# EAGLE design Module_Expansion_Mosfet (EAGLE 9.6.2)
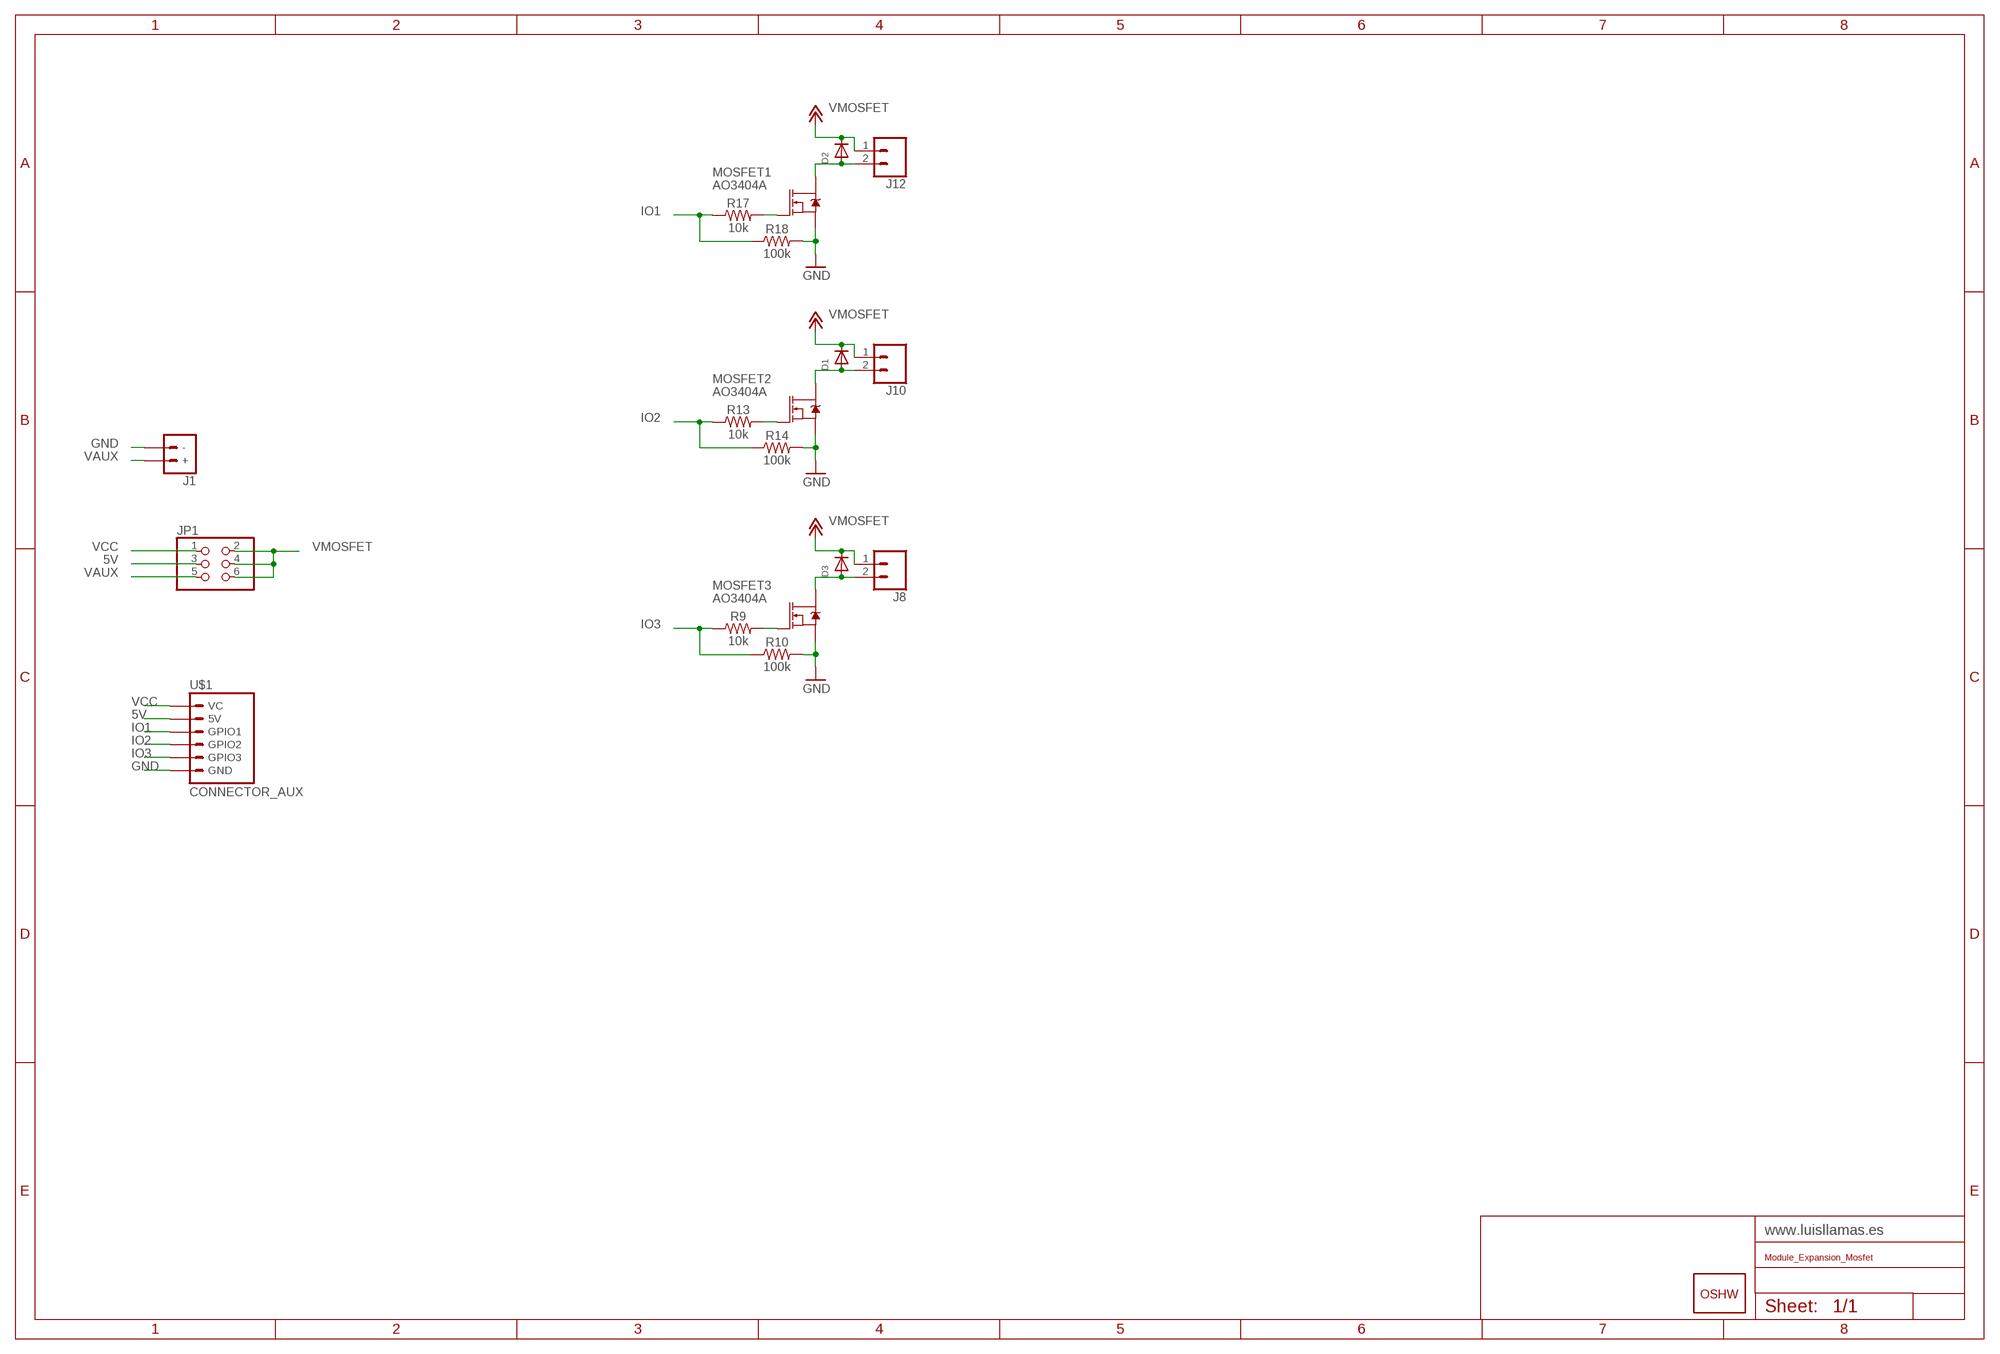
[diagram p0: schematic, sheet 1]

## Parts
D1  DIODESOD-123  [SOD-123]
D2  DIODESOD-123  [SOD-123]
D3  DIODESOD-123  [SOD-123]
GOLD_ORB_SM1  OSHWLOGO_GOLD_ORB_MED  [OSHW1]
J1  POWER-TERMINAL2.54MM_SCREWTERM  [1X02_2.54_SCREWTERM]
J8  CONN_02LOCK_LONGPADS  [1X02_LOCK_LONGPADS]
J10  CONN_02LOCK_LONGPADS  [1X02_LOCK_LONGPADS]
J12  CONN_02LOCK_LONGPADS  [1X02_LOCK_LONGPADS]
JP1  JUMPER_3X2/OCT  [JUMPER_3X2]
MOSFET1  AO3404A  MOSFET-NCH-AO3404A  [SOT23-3]
MOSFET2  AO3404A  MOSFET-NCH-AO3404A  [SOT23-3]
MOSFET3  AO3404A  MOSFET-NCH-AO3404A  [SOT23-3]
R9  10k  RESISTOR1206  [1206]
R10  100k  RESISTOR1206  [1206]
R13  10k  RESISTOR1206  [1206]
R14  100k  RESISTOR1206  [1206]
R17  10k  RESISTOR1206  [1206]
R18  100k  RESISTOR1206  [1206]
U$1  CONNECTOR_AUX  [CONNECTOR_AUX]

## Nets
5V: JP1.3 U$1.5V
GND: J1.- MOSFET1.2(S) MOSFET2.2(S) MOSFET3.2(S) R10.2 R14.2 R18.2 U$1.GND
IO1: R17.1 R18.1 U$1.GPIO1
IO2: R13.1 R14.1 U$1.GPIO2
IO3: R9.1 R10.1 U$1.GPIO3
N$14: MOSFET3.1(G) R9.2
N$15: D3.A J8.2 MOSFET3.3(D)
N$20: MOSFET2.1(G) R13.2
N$21: D1.A J10.2 MOSFET2.3(D)
N$26: MOSFET1.1(G) R17.2
N$27: D2.A J12.2 MOSFET1.3(D)
VAUX: J1.+ JP1.5
VCC: JP1.1 U$1.VC
VMOSFET: D1.C D2.C D3.C J8.1 J10.1 J12.1 JP1.2 JP1.4 JP1.6 ; supply symbol labelled +12V

## Library data of the parts
D1-D3 = adafruit:DIODE: Diode SMADIODE - SMA Surface Mount Package 20V 1A Schottky Diode Digikey: 641-1014-6-ND DO-1N4148 - Through Hole Small Current Diode SOD-123 20V 1 A (.5mV Vf) Schottky Diode - Digikey: MBRX120TPMSCT-ND SOD-323 10V 570mA (.38mV Vf, 3ns) Schottky Diode - Digikey: ZLLS410CT-ND SOD-523 30V 30mA Schottky Diode (RB751S-40TE61) - Digikey: RB751S-40TE61CT-ND SOT23-R/W - SOT23 Package (R = Solder Paste/Reflow Ovens, W = Hand-Soldering) BAT54Film 40V 300mA - Digikey: 497-7162-1-ND
GOLD_ORB_SM1 = LLL_Frames:OSHWLOGO: These are Open-Source Hardware logos.
J1 = LLL_Power:POWER-TERMINAL: Multi connection point. Often used as Generic Header-pin footprint for 0.1 inch spaced/style header connections On any of the 0.1 inch spaced packages, you can populate with these: Break Away Headers - Straight <https://www.sparkfun.com/products/116> (PRT-00116) Break Away Male Headers - Right Angle <https://www.sparkfun.com/products/553> (PRT-00553) Female Headers <https://www.sparkfun.com/products/115> (PRT-00115) Break Away Headers - Machine Pin <https://www.sparkfun.com/products/117> (PRT-00117) Break Away Female Headers - Swiss Machine Pin <https://www.sparkfun.com/products/743> (PRT-00743) For SCREWTERMINALS and SPRING TERMINALS visit here: Screw Terimnals on SparkFun.com <https://www.sparkfun.com/search/results?term=Screw+Terminals> (5mm/3.5mm/2.54mm spacing) This device is also useful as a general connection point to wire up your design to another part of your project. Our various solder wires solder well into these plated through hole pads. Hook-Up Wire - Assortment (Stranded, 22 AWG) <https://www.sparkfun.com/products/11375> (PRT-11375) Hook-Up Wire - Assortment (Solid Core, 22 AWG) <https://www.sparkfun.com/products/11367> (PRT-11367) View the entire wire category on our website here <https://www.sparkfun.com/categories/141> Special notes: Molex polarized connector foot print use with: PRT-08233 with associated crimp pins and housings. 2.54_SCREWTERM for use with PRT-10571. 3.5mm Screw Terminal footprints for PRT-08084 5mm Screw Terminal footprints for use with PRT-08432
J8 J10 J12 = LLL_Connectors:CONN_02: Multi connection point. Often used as Generic Header-pin footprint for 0.1 inch spaced/style header connections On any of the 0.1 inch spaced packages, you can populate with these: Break Away Headers - Straight <https://www.sparkfun.com/products/116> (PRT-00116) Break Away Male Headers - Right Angle <https://www.sparkfun.com/products/553> (PRT-00553) Female Headers <https://www.sparkfun.com/products/115> (PRT-00115) Break Away Headers - Machine Pin <https://www.sparkfun.com/products/117> (PRT-00117) Break Away Female Headers - Swiss Machine Pin <https://www.sparkfun.com/products/743> (PRT-00743) For SCREWTERMINALS and SPRING TERMINALS visit here: Screw Terimnals on SparkFun.com <https://www.sparkfun.com/search/results?term=Screw+Terminals> (5mm/3.5mm/2.54mm spacing) This device is also useful as a general connection point to wire up your design to another part of your project. Our various solder wires solder well into these plated through hole pads. Hook-Up Wire - Assortment (Stranded, 22 AWG) <https://www.sparkfun.com/products/11375> (PRT-11375) Hook-Up Wire - Assortment (Solid Core, 22 AWG) <https://www.sparkfun.com/products/11367> (PRT-11367) View the entire wire category on our website here <https://www.sparkfun.com/categories/141> Special notes: Molex polarized connector foot print use with: PRT-08233 with associated crimp pins and housings. 2.54_SCREWTERM for use with PRT-10571. 3.5mm Screw Terminal footprints for PRT-08084 5mm Screw Terminal footprints for use with PRT-08432
JP1 = LLL_Jumpers:JUMPER_3X2: Header ISR
MOSFET1-MOSFET3 = SparkFun-DiscreteSemi:MOSFET-NCH: N-channel MOSFETs Voltage controlled devices that allow control of high current outputs. SparkFun Products: SparkFun OpenScale <https://www.sparkfun.com/products/13261> SparkFun Digital Sandbox <https://www.sparkfun.com/products/12651> SparkFun Monster Moto Shield <https://www.sparkfun.com/products/10182> SparkFun MOSFET Power Controller <https://www.sparkfun.com/products/11214>; PROD_ID: TRANS-12988; VALUE: 5.8A/30V/35mΩ
R9 R10 R13 R14 R17 R18 = SparkFun-Resistors:RESISTOR: Generic Resistor Package
U$1 = LLL_Connectors:CONNECTOR_AUX

## Net classes
0 default: clearance 0.205 mm

## Board
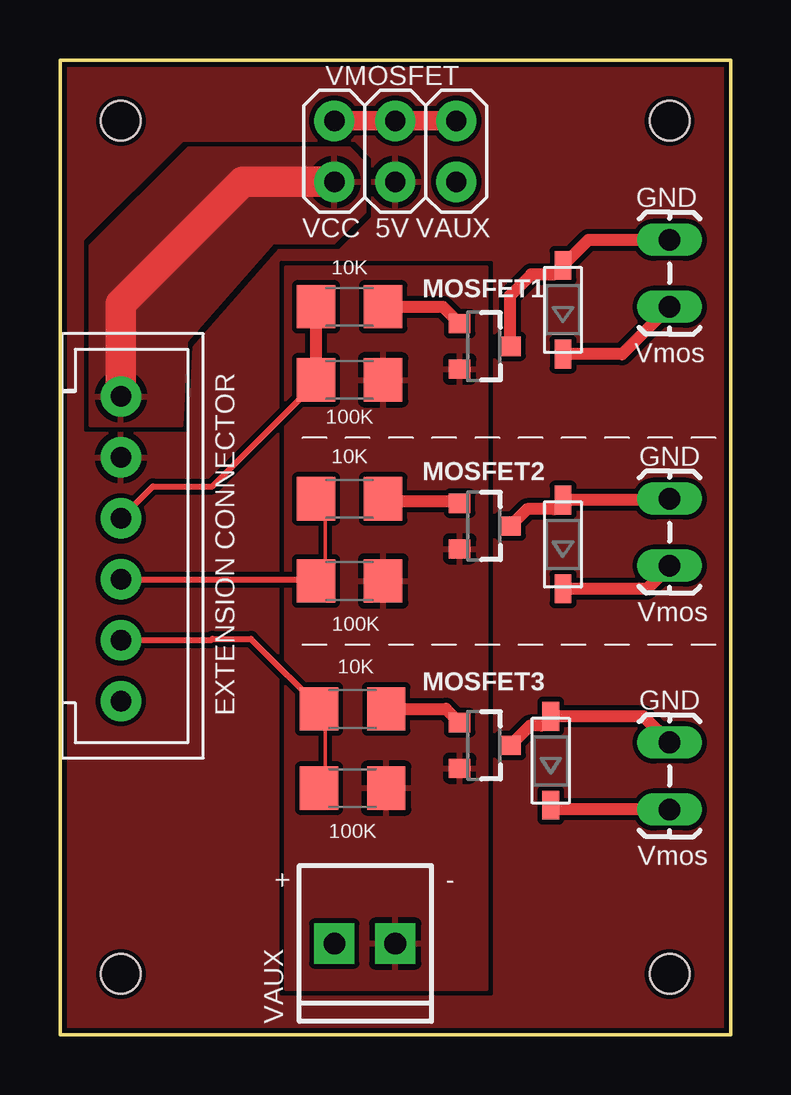
[diagram p1: board, top side]
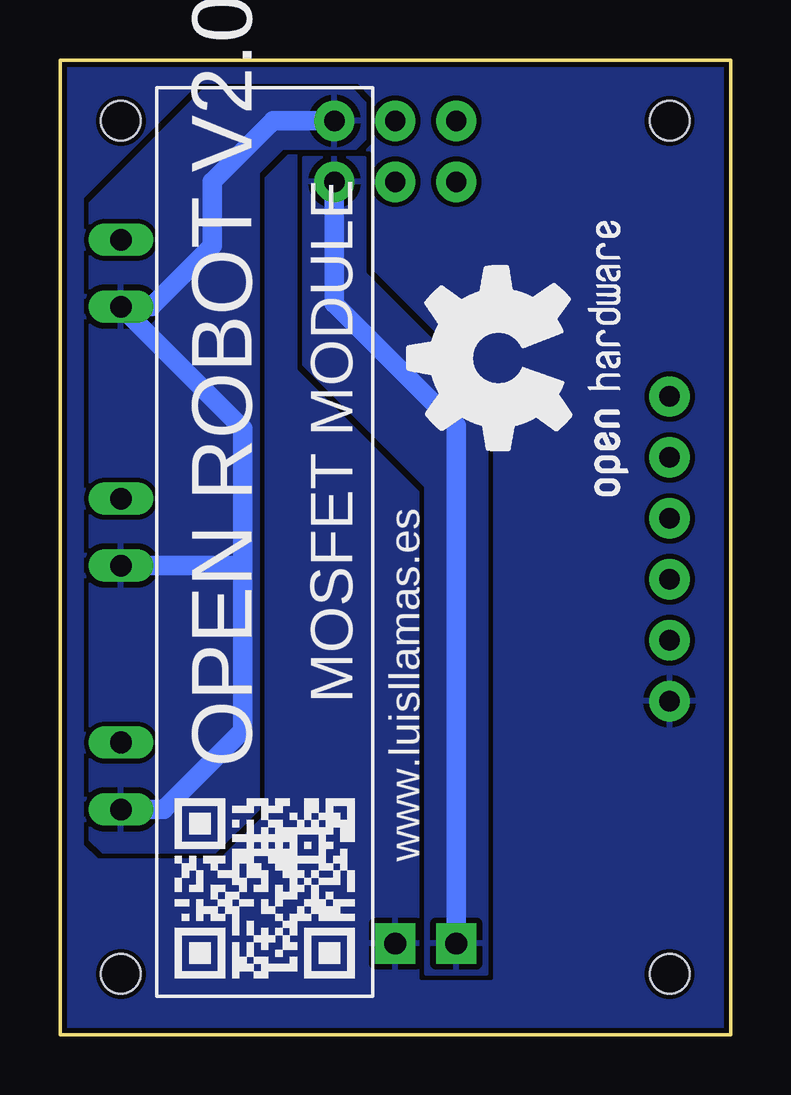
[diagram p2: board, bottom side, seen from below]

Size 27.94 x 40.64 mm. Coordinates in mm from the lower left corner, seen from the top.
Outline: 0,40.64 0,0 27.94,0 27.94,40.64 0,40.64
Copper layers (1*16): Top 0.035559375mm / dielectric 1.6mm / Bottom 0.035559375mm
Design rules "jlcpcb2layer": minimum track width 5mil, minimum drill 12mil, track to track 5mil, track to pad 5mil, pad to pad 5mil, via to via 5mil, smd to smd 5mil, copper to edge 8mil, drill to drill 6mil, minimum pad ring 5mil, minimum via ring 3mil, stop-mask expansion 2.5mil, vias tented up to drill 0mil, thermal gap 10mil
Holes 1.65 mm at 2.54,38.1 2.54,2.54 25.4,38.1 25.4,2.54

### Footprints (pad centres in the part's own frame; a part is rotated, then mirrored left to right if it is on the bottom)
SOD-123 = smd 1.2 x 0.7: A 1.85,0; C -1.85,0
1X02_2.54_SCREWTERM = drill 0.9 pad 1.676 square: + 2.54,0; - 0,0
1X02_LOCK_LONGPADS = drill 0.9 long: 1 -0.127,0; 2 2.667,0
JUMPER_3X2 = drill 0.85 pad 1.676: 1 -2.54,-1.27; 2 -2.54,1.27; 3 0,-1.27; 4 0,1.27; 5 2.54,-1.27; 6 2.54,1.27
SOT23-3 = smd 0.8 x 0.9: 1 -0.95,-1; 2 0.95,-1; 3 0,1.1
1206 = smd 1.6 x 1.8: 1 -1.4,0; 2 1.4,0
CONNECTOR_AUX = drill 0.85 pad 1.676: 5V 0,-3.754; GND 0,6.406; GPIO1 0,-1.214; GPIO2 0,1.326; GPIO3 0,3.866; VC 0,-6.294

### Placement (x,y rotation side)
D1  20.95,20.45 90 top
D2  20.95,30.23 90 top
D3  20.45,11.43 90 top
GOLD_ORB_SM1  2.54,21.84 90 bottom
J1  13.97,3.81 180 top
J8  25.4,9.53 90 top
J10  25.4,19.68 90 top
J12  25.4,30.48 90 top
JP1  13.97,36.83 0 top
MOSFET1  17.65,28.7 270 top
MOSFET2  17.65,21.21 270 top
MOSFET3  17.65,12.06 270 top
R9  12.19,13.59 0 top
R10  12.19,10.29 0 top
R13  12.06,22.35 0 top
R14  12.06,18.92 0 top
R17  12.06,30.35 0 top
R18  12.06,27.3 0 top
U$1  2.54,20.32 180 top

### Tracks (layer width: path | path; a pad name or v marks a point on that pad's centre or on a via)
5V
  pour Top (rank 2): 0,0 0,40.64 27.94,40.64 27.94,0
GND
  pour Bottom (rank 2): 0,0 0,40.64 27.94,40.64 27.94,0
  pour Top: 17.78,32 9.4,32 9.4,1.91 17.78,1.91
IO1
  Top 0.254: U$1.GPIO1 3.87,22.86 6.35,22.86 10.66,27.18 R18.1
  Top 0.508: R17.1 R18.1
IO2
  Top 0.152: R14.1 11.05,19.3 11.05,22.1 R13.1
  Top 0.254: U$1.GPIO2 10.59,18.99 R14.1
IO3
  Top 0.152: R10.1 11.05,10.29 11.05,13.42 R9.1
  Top 0.254: U$1.GPIO3 6.29,16.45 6.35,16.51 7.96,16.51 11.05,13.42
N$14
  Top 0.508: R9.2 16.08,13.59 MOSFET3.1
N$15
  Top 0.508: MOSFET3.3 19.59,12.9 20.07,12.9 D3.A 24.31,13.28 J8.2
N$20
  Top 0.508: R13.2 13.59,22.23 16.59,22.23 MOSFET2.1
N$21
  Top 0.508: J10.2 25.34,22.3 D1.A 20.57,21.92 19.46,21.92 MOSFET2.3
N$26
  Top 0.508: R17.2 15.95,30.35 MOSFET1.1
N$27
  Top 0.508: MOSFET1.3 18.75,30.82 19.63,31.7 20.57,31.7 D2.A 22.03,33.15 J12.2
VAUX
  Bottom 0.813: JP1.5 16.51,30.48 11.43,25.4 J1.+
  pour Bottom: 15.24,36.58 17.78,36.58 17.78,27.94 12.7,22.86 12.7,2.54 10.16,2.54 10.16,26.67 15.24,31.75
VCC
  Top 1.27: U$1.VC 2.54,30.48 7.62,35.56 JP1.1
  pour Top: 1.27,32.89 5.33,36.96 12.06,36.96 12.7,36.32 12.7,34.29 11.43,33.02 8.89,33.02 5.27,28.89 5.08,25.4 1.27,25.4
VMOSFET
  Top 0.508: J12.1 23.42,28.38 D2.C | J10.1 24.44,18.6 D1.C | J8.1 20.63,9.4 D3.C
  Top 0.813: JP1.2 JP1.4 JP1.6
  Bottom 0.813: JP1.6 19.05,38.1 21.59,35.56 21.59,32.89 24.13,30.35 J12.1 20.32,25.27 20.32,19.56 | J8.1 23.62,9.4 20.32,12.7 20.32,19.56 | J10.1 20.32,19.56
  pour Bottom: 21.97,39.37 15.75,39.37 15.24,38.86 15.24,37.34 15.62,36.96 18.67,36.96 19.68,35.94 19.68,9.4 21.46,7.62 26.16,7.62 26.67,8.13 26.67,34.67

### Text on the board
tPlace: VMOSFET | GND | VCC | 5V | VAUX | 10K | Vmos | 100K | 10K | GND | EXTENSION CONNECTOR | Vmos | 100K | 10K | GND | 100K | Vmos | + | - | VAUX
bPlace: MOSFET MODULE | OPEN ROBOT V2.0 | www.luisllamas.es